# Altium schematic sheet QCW MMC PCBA.SchDoc
size A4
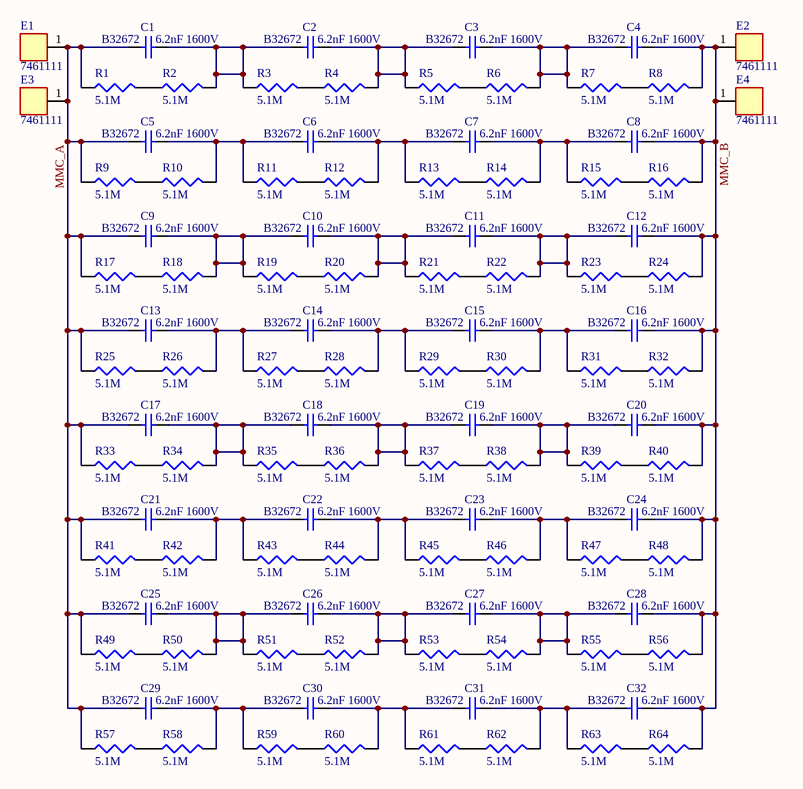
[diagram p0: QCW MMC PCBA.SchDoc]

## Parts
C1  B32672  value 6.2nF 1600V  [B32672 6n2 1600V]
C2  B32672  value 6.2nF 1600V  [B32672 6n2 1600V]
C3  B32672  value 6.2nF 1600V  [B32672 6n2 1600V]
C4  B32672  value 6.2nF 1600V  [B32672 6n2 1600V]
C5  B32672  value 6.2nF 1600V  [B32672 6n2 1600V]
C6  B32672  value 6.2nF 1600V  [B32672 6n2 1600V]
C7  B32672  value 6.2nF 1600V  [B32672 6n2 1600V]
C8  B32672  value 6.2nF 1600V  [B32672 6n2 1600V]
C9  B32672  value 6.2nF 1600V  [B32672 6n2 1600V]
C10  B32672  value 6.2nF 1600V  [B32672 6n2 1600V]
C11  B32672  value 6.2nF 1600V  [B32672 6n2 1600V]
C12  B32672  value 6.2nF 1600V  [B32672 6n2 1600V]
C13  B32672  value 6.2nF 1600V  [B32672 6n2 1600V]
C14  B32672  value 6.2nF 1600V  [B32672 6n2 1600V]
C15  B32672  value 6.2nF 1600V  [B32672 6n2 1600V]
C16  B32672  value 6.2nF 1600V  [B32672 6n2 1600V]
C17  B32672  value 6.2nF 1600V  [B32672 6n2 1600V]
C18  B32672  value 6.2nF 1600V  [B32672 6n2 1600V]
C19  B32672  value 6.2nF 1600V  [B32672 6n2 1600V]
C20  B32672  value 6.2nF 1600V  [B32672 6n2 1600V]
C21  B32672  value 6.2nF 1600V  [B32672 6n2 1600V]
C22  B32672  value 6.2nF 1600V  [B32672 6n2 1600V]
C23  B32672  value 6.2nF 1600V  [B32672 6n2 1600V]
C24  B32672  value 6.2nF 1600V  [B32672 6n2 1600V]
C25  B32672  value 6.2nF 1600V  [B32672 6n2 1600V]
C26  B32672  value 6.2nF 1600V  [B32672 6n2 1600V]
C27  B32672  value 6.2nF 1600V  [B32672 6n2 1600V]
C28  B32672  value 6.2nF 1600V  [B32672 6n2 1600V]
C29  B32672  value 6.2nF 1600V  [B32672 6n2 1600V]
C30  B32672  value 6.2nF 1600V  [B32672 6n2 1600V]
C31  B32672  value 6.2nF 1600V  [B32672 6n2 1600V]
C32  B32672  value 6.2nF 1600V  [B32672 6n2 1600V]
E1  7461111  [7461111_HAL Surface]
E2  7461111  [7461111_HAL Surface]
E3  7461111  [7461111_HAL Surface]
E4  7461111  [7461111_HAL Surface]
R1  value 5.1M  [RES_1206_HV]  (hidden comment: HV 1206 Resistor)
R2  value 5.1M  [RES_1206_HV]  (hidden comment: HV 1206 Resistor)
R3  value 5.1M  [RES_1206_HV]  (hidden comment: HV 1206 Resistor)
R4  value 5.1M  [RES_1206_HV]  (hidden comment: HV 1206 Resistor)
R5  value 5.1M  [RES_1206_HV]  (hidden comment: HV 1206 Resistor)
R6  value 5.1M  [RES_1206_HV]  (hidden comment: HV 1206 Resistor)
R7  value 5.1M  [RES_1206_HV]  (hidden comment: HV 1206 Resistor)
R8  value 5.1M  [RES_1206_HV]  (hidden comment: HV 1206 Resistor)
R9  value 5.1M  [RES_1206_HV]  (hidden comment: HV 1206 Resistor)
R10  value 5.1M  [RES_1206_HV]  (hidden comment: HV 1206 Resistor)
R11  value 5.1M  [RES_1206_HV]  (hidden comment: HV 1206 Resistor)
R12  value 5.1M  [RES_1206_HV]  (hidden comment: HV 1206 Resistor)
R13  value 5.1M  [RES_1206_HV]  (hidden comment: HV 1206 Resistor)
R14  value 5.1M  [RES_1206_HV]  (hidden comment: HV 1206 Resistor)
R15  value 5.1M  [RES_1206_HV]  (hidden comment: HV 1206 Resistor)
R16  value 5.1M  [RES_1206_HV]  (hidden comment: HV 1206 Resistor)
R17  value 5.1M  [RES_1206_HV]  (hidden comment: HV 1206 Resistor)
R18  value 5.1M  [RES_1206_HV]  (hidden comment: HV 1206 Resistor)
R19  value 5.1M  [RES_1206_HV]  (hidden comment: HV 1206 Resistor)
R20  value 5.1M  [RES_1206_HV]  (hidden comment: HV 1206 Resistor)
R21  value 5.1M  [RES_1206_HV]  (hidden comment: HV 1206 Resistor)
R22  value 5.1M  [RES_1206_HV]  (hidden comment: HV 1206 Resistor)
R23  value 5.1M  [RES_1206_HV]  (hidden comment: HV 1206 Resistor)
R24  value 5.1M  [RES_1206_HV]  (hidden comment: HV 1206 Resistor)
R25  value 5.1M  [RES_1206_HV]  (hidden comment: HV 1206 Resistor)
R26  value 5.1M  [RES_1206_HV]  (hidden comment: HV 1206 Resistor)
R27  value 5.1M  [RES_1206_HV]  (hidden comment: HV 1206 Resistor)
R28  value 5.1M  [RES_1206_HV]  (hidden comment: HV 1206 Resistor)
R29  value 5.1M  [RES_1206_HV]  (hidden comment: HV 1206 Resistor)
R30  value 5.1M  [RES_1206_HV]  (hidden comment: HV 1206 Resistor)
R31  value 5.1M  [RES_1206_HV]  (hidden comment: HV 1206 Resistor)
R32  value 5.1M  [RES_1206_HV]  (hidden comment: HV 1206 Resistor)
R33  value 5.1M  [RES_1206_HV]  (hidden comment: HV 1206 Resistor)
R34  value 5.1M  [RES_1206_HV]  (hidden comment: HV 1206 Resistor)
R35  value 5.1M  [RES_1206_HV]  (hidden comment: HV 1206 Resistor)
R36  value 5.1M  [RES_1206_HV]  (hidden comment: HV 1206 Resistor)
R37  value 5.1M  [RES_1206_HV]  (hidden comment: HV 1206 Resistor)
R38  value 5.1M  [RES_1206_HV]  (hidden comment: HV 1206 Resistor)
R39  value 5.1M  [RES_1206_HV]  (hidden comment: HV 1206 Resistor)
R40  value 5.1M  [RES_1206_HV]  (hidden comment: HV 1206 Resistor)
R41  value 5.1M  [RES_1206_HV]  (hidden comment: HV 1206 Resistor)
R42  value 5.1M  [RES_1206_HV]  (hidden comment: HV 1206 Resistor)
R43  value 5.1M  [RES_1206_HV]  (hidden comment: HV 1206 Resistor)
R44  value 5.1M  [RES_1206_HV]  (hidden comment: HV 1206 Resistor)
R45  value 5.1M  [RES_1206_HV]  (hidden comment: HV 1206 Resistor)
R46  value 5.1M  [RES_1206_HV]  (hidden comment: HV 1206 Resistor)
R47  value 5.1M  [RES_1206_HV]  (hidden comment: HV 1206 Resistor)
R48  value 5.1M  [RES_1206_HV]  (hidden comment: HV 1206 Resistor)
R49  value 5.1M  [RES_1206_HV]  (hidden comment: HV 1206 Resistor)
R50  value 5.1M  [RES_1206_HV]  (hidden comment: HV 1206 Resistor)
R51  value 5.1M  [RES_1206_HV]  (hidden comment: HV 1206 Resistor)
R52  value 5.1M  [RES_1206_HV]  (hidden comment: HV 1206 Resistor)
R53  value 5.1M  [RES_1206_HV]  (hidden comment: HV 1206 Resistor)
R54  value 5.1M  [RES_1206_HV]  (hidden comment: HV 1206 Resistor)
R55  value 5.1M  [RES_1206_HV]  (hidden comment: HV 1206 Resistor)
R56  value 5.1M  [RES_1206_HV]  (hidden comment: HV 1206 Resistor)
R57  value 5.1M  [RES_1206_HV]  (hidden comment: HV 1206 Resistor)
R58  value 5.1M  [RES_1206_HV]  (hidden comment: HV 1206 Resistor)
R59  value 5.1M  [RES_1206_HV]  (hidden comment: HV 1206 Resistor)
R60  value 5.1M  [RES_1206_HV]  (hidden comment: HV 1206 Resistor)
R61  value 5.1M  [RES_1206_HV]  (hidden comment: HV 1206 Resistor)
R62  value 5.1M  [RES_1206_HV]  (hidden comment: HV 1206 Resistor)
R63  value 5.1M  [RES_1206_HV]  (hidden comment: HV 1206 Resistor)
R64  value 5.1M  [RES_1206_HV]  (hidden comment: HV 1206 Resistor)

## Nets
MMC_A: C1.1 C5.1 C9.1 C13.1 C17.1 C21.1 C25.1 C29.1 E1.1 E3.1 R1.1 R9.1 R17.1 R25.1 R33.1 R41.1 R49.1 R57.1
MMC_B: C4.2 C8.2 C12.2 C16.2 C20.2 C24.2 C28.2 C32.2 E2.1 E4.1 R8.2 R16.2 R24.2 R32.2 R40.2 R48.2 R56.2 R64.2
NetC1_2: C1.2 C2.1 R2.2 R3.1
NetC2_2: C2.2 C3.1 R4.2 R5.1
NetC3_2: C3.2 C4.1 R6.2 R7.1
NetC5_2: C5.2 C6.1 R10.2 R11.1
NetC6_2: C6.2 C7.1 R12.2 R13.1
NetC7_2: C7.2 C8.1 R14.2 R15.1
NetC9_2: C9.2 C10.1 R18.2 R19.1
NetC10_2: C10.2 C11.1 R20.2 R21.1
NetC11_2: C11.2 C12.1 R22.2 R23.1
NetC13_2: C13.2 C14.1 R26.2 R27.1
NetC14_2: C14.2 C15.1 R28.2 R29.1
NetC15_2: C15.2 C16.1 R30.2 R31.1
NetC17_2: C17.2 C18.1 R34.2 R35.1
NetC18_2: C18.2 C19.1 R36.2 R37.1
NetC19_2: C19.2 C20.1 R38.2 R39.1
NetC21_2: C21.2 C22.1 R42.2 R43.1
NetC22_2: C22.2 C23.1 R44.2 R45.1
NetC23_2: C23.2 C24.1 R46.2 R47.1
NetC25_2: C25.2 C26.1 R50.2 R51.1
NetC26_2: C26.2 C27.1 R52.2 R53.1
NetC27_2: C27.2 C28.1 R54.2 R55.1
NetC29_2: C29.2 C30.1 R58.2 R59.1
NetC30_2: C30.2 C31.1 R60.2 R61.1
NetC31_2: C31.2 C32.1 R62.2 R63.1
NetR1_2: R1.2 R2.1
NetR3_2: R3.2 R4.1
NetR5_2: R5.2 R6.1
NetR7_2: R7.2 R8.1
NetR9_2: R9.2 R10.1
NetR11_2: R11.2 R12.1
NetR13_2: R13.2 R14.1
NetR15_2: R15.2 R16.1
NetR17_2: R17.2 R18.1
NetR19_2: R19.2 R20.1
NetR21_2: R21.2 R22.1
NetR23_2: R23.2 R24.1
NetR25_2: R25.2 R26.1
NetR27_2: R27.2 R28.1
NetR29_2: R29.2 R30.1
NetR31_2: R31.2 R32.1
NetR33_2: R33.2 R34.1
NetR35_2: R35.2 R36.1
NetR37_2: R37.2 R38.1
NetR39_2: R39.2 R40.1
NetR41_2: R41.2 R42.1
NetR43_2: R43.2 R44.1
NetR45_2: R45.2 R46.1
NetR47_2: R47.2 R48.1
NetR49_2: R49.2 R50.1
NetR51_2: R51.2 R52.1
NetR53_2: R53.2 R54.1
NetR55_2: R55.2 R56.1
NetR57_2: R57.2 R58.1
NetR59_2: R59.2 R60.1
NetR61_2: R61.2 R62.1
NetR63_2: R63.2 R64.1

## Library data of the parts
C1-C32 = Cap: Capacitor; Published: 8-Jun-2000; LatestRevisionDate: 17-Jul-2002; LatestRevisionNote: Re-released for DXP Platform.; PackageReference: RAD-0.3; Publisher: Altium Limited; PackageDescription: Radial Cap, Thru-Hole; 2 Leads; 0.3 in Pin Spacing
E1-E4 = WP-RAFU,  7461111: WP-RAFU 90° with Full Plain Pin Plate, M4, thr 5mm; Manufacturer: Wurth Elektronik; partNo: 7461111; ComponentLink1Description: Manufacturer; ComponentLink1URL: http://www.we-online.de; Created by: Baojun Chen; Created Date: Dec.2015; ComponentLink2Description: Datasheet; ComponentLink2URL: http://katalog.we-online.de/em/datasheet/7461111.pdf
R1-R64 = Res3: Resistor; Published: 8-Jun-2000; LatestRevisionDate: 29-May-2009; LatestRevisionNote: IPC-7351 Footprint Added.; PackageReference: J1-0603; Publisher: Altium Limited; PackageDescription: Chip Resistor